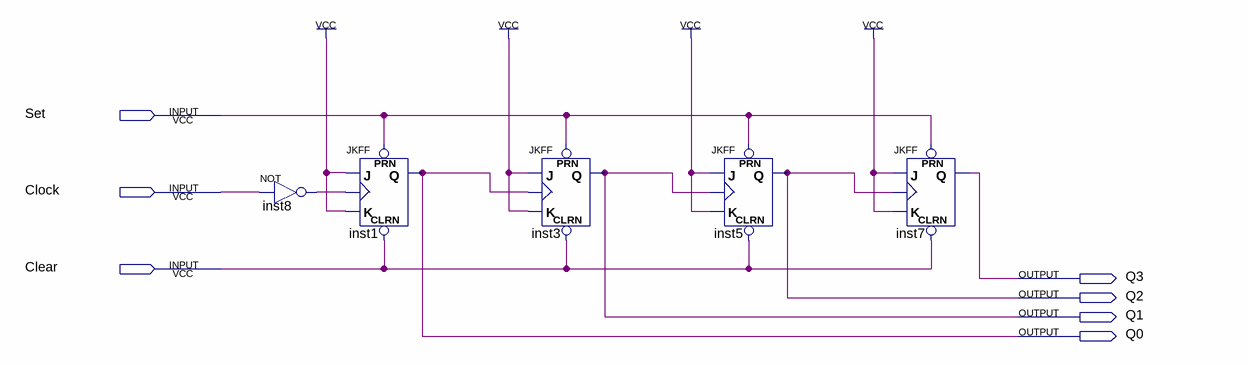
[diagram p0: schematic sheet]
// Quartus schematic counter2.bdf as structural Verilog: 5 symbols, 7 pins
module counter2 (
  input  Set,
  input  Clock,
  input  Clear,
  output Q3,
  output Q2,
  output Q1,
  output Q0
);

  wire inst8_out;

  not inst8 (inst8_out, Clock);
  JKFF inst1 (.PRN(Set), .CLRN(Clear), .K(1'b1), .J(1'b1), .CLK(inst8_out), .Q(Q0));
  JKFF inst3 (.PRN(Set), .CLRN(Clear), .K(1'b1), .J(1'b1), .CLK(Q0), .Q(Q1));
  JKFF inst5 (.PRN(Set), .CLRN(Clear), .K(1'b1), .J(1'b1), .CLK(Q1), .Q(Q2));
  JKFF inst7 (.PRN(Set), .CLRN(Clear), .K(1'b1), .J(1'b1), .CLK(Q2), .Q(Q3));
endmodule
